# Altium project PCB_Project.PrjPcb (part 2 of 2)

## Sheet 12V_Buck_fans.SchDoc
size A; SheetNumber: 7; SheetTotal: 17
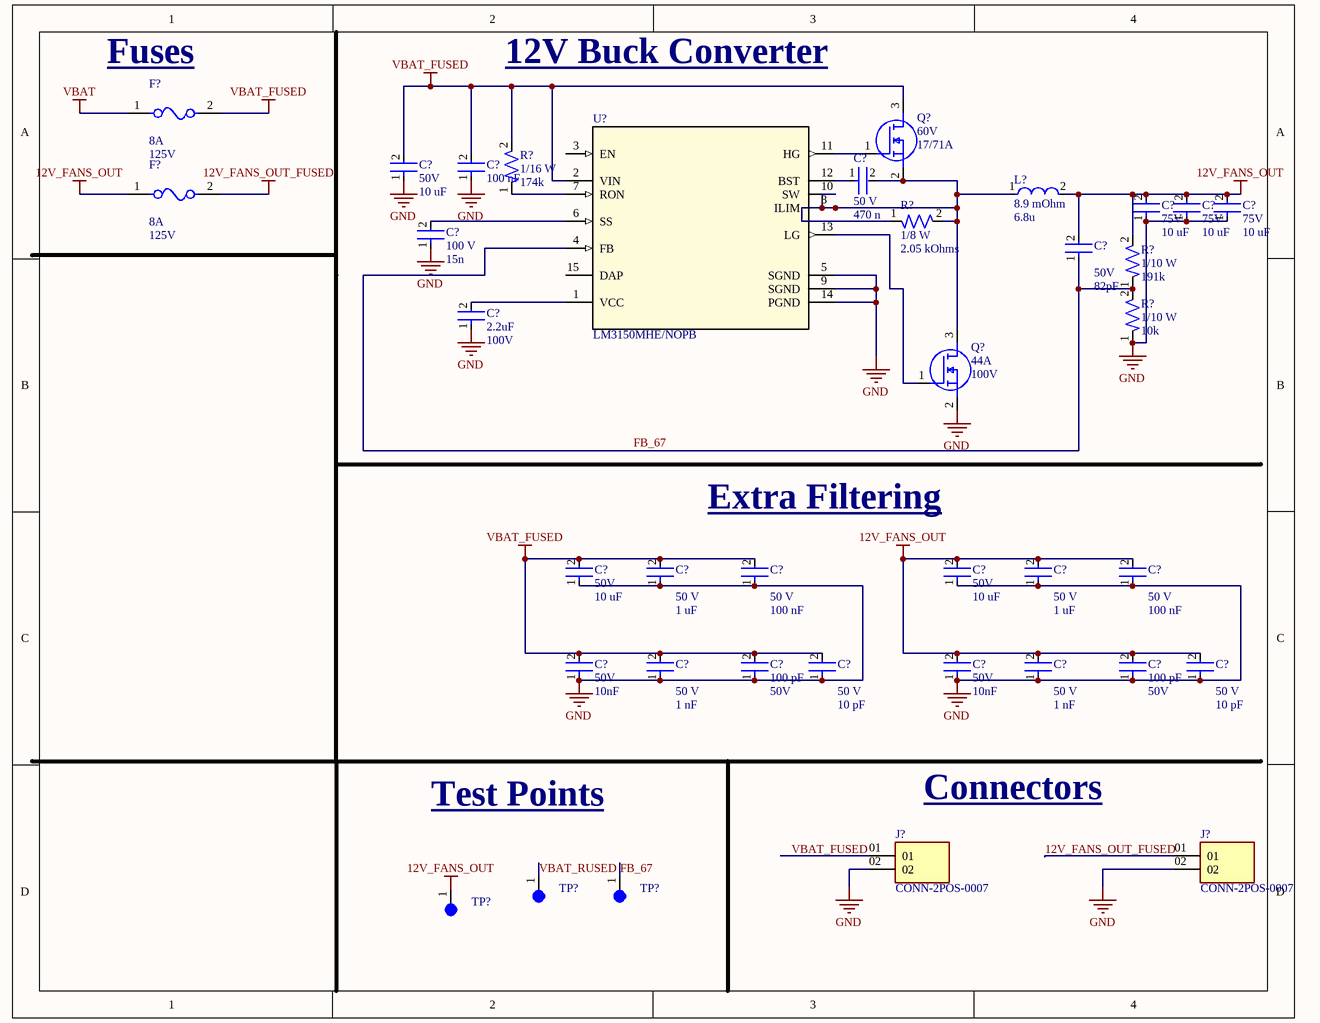
[diagram p6: 12V_Buck_fans.SchDoc]

### Parts
(Parts that share a designator on the sheet are numbered #1, #2 ... from top to bottom, then left to right.)
C?#113  Capacitance: 100 nF  [CAP-0603]  (hidden comment: GMC10X7S104K100NT)
C?#114  Voltage: 50V  Capacitance: 10 uF  [CAP-1210]  (hidden comment: CL32B106KBJNNNE)
C?#115  Voltage: 50 V  Capacitance: 470 n  [CAP-0805]  (hidden comment: CC0805ZRY5V9BB474)
C?#116  Voltage: 75V  Capacitance: 10 uF  [CAP-1210-0001]  (hidden comment: C3225X7R1N106K250AC)
C?#117  Voltage: 75V  Capacitance: 10 uF  [CAP-1210-0001]  (hidden comment: C3225X7R1N106K250AC)
C?#118  Voltage: 75V  Capacitance: 10 uF  [CAP-1210-0001]  (hidden comment: C3225X7R1N106K250AC)
C?#119  Voltage: 100 V  Capacitance: 15n  [CAP-0805]  (hidden comment: CC0805KRX7R0BB153)
C?#120  Voltage: 50V  Capacitance: 82pF  [CAP-0805]  (hidden comment: CC0805JRNPO9BN820)
C?#121  Capacitance: 2.2uF  Voltage: 100V  [CAP-1206]  (hidden comment: CC1206KKX7R0BB225)
C?#122  Voltage: 50 V  Capacitance: 1 uF  [CAP-0805]  (hidden comment: CC0805KKX7R9BB105)
C?#123  Voltage: 50 V  Capacitance: 100 nF  [CAP-0805]  (hidden comment: CC0805KRX7R9BB104)
C?#124  Voltage: 50 V  Capacitance: 1 uF  [CAP-0805]  (hidden comment: CC0805KKX7R9BB105)
C?#125  Voltage: 50 V  Capacitance: 100 nF  [CAP-0805]  (hidden comment: CC0805KRX7R9BB104)
C?#126  Voltage: 50V  Capacitance: 10 uF  [CAP-1210]  (hidden comment: CL32B106KBJNNNE)
C?#127  Voltage: 50V  Capacitance: 10 uF  [CAP-1210]  (hidden comment: CL32B106KBJNNNE)
C?#128  Voltage: 50 V  Capacitance: 1 nF  [CAP-0402]  (hidden comment: CC0402KRX7R9BB102)
C?#129  Voltage: 50 V  Capacitance: 10 pF  [CAP-0402]  (hidden comment: CC0402JRNPO9BN100)
C?#130  Voltage: 50 V  Capacitance: 1 nF  [CAP-0402]  (hidden comment: CC0402KRX7R9BB102)
C?#131  Voltage: 50 V  Capacitance: 10 pF  [CAP-0402]  (hidden comment: CC0402JRNPO9BN100)
C?#132  Voltage: 50V  Capacitance: 10nF  [CAP-0805]  (hidden comment: GRM2195C1H103JA01D)
C?#133  Capacitance: 100 pF  Voltage: 50V  [CAP-0402]  (hidden comment: CC0402JRNPO9BN101)
C?#134  Voltage: 50V  Capacitance: 10nF  [CAP-0805]  (hidden comment: GRM2195C1H103JA01D)
C?#135  Capacitance: 100 pF  Voltage: 50V  [CAP-0402]  (hidden comment: CC0402JRNPO9BN101)
F?#11  Fuse Current: 8A  Voltage Rating: 125V  [FUSE-0001]  (hidden comment: 01550900M)
F?#12  Fuse Current: 8A  Voltage Rating: 125V  [FUSE-0001]  (hidden comment: 01550900M)
J?#12  CONN-2POS-0007  [SAMTEC_HFWJ-02-02-T-S]
J?#13  CONN-2POS-0007  [SAMTEC_HFWJ-02-02-T-S]
L?#6  Resistance: 8.9 mOhm  Inductance: 6.8u  (hidden comment: XAL1010-682MED)
Q?#12  Vdss: 60V  Current: 17/71A  [NTMFS5C670NLT1G_ONS]  (hidden comment: NTMFS5C670NLT1G)
Q?#13  Current: 44A  Vdss: 100V  [TRANS_CSD19534Q5A]  (hidden comment: CSD19534Q5A)
R?#24  Power: 1/16 W  Resistance: 174k  [RES-0402]  (hidden comment: RC0402FR-07174KL)
R?#25  Power: 1/8 W  Resistance: 2.05 kOhms  [RES-0805]  (hidden comment: RC0805FR-072K05L)
R?#26  Power: 1/10 W  Resistance: 191k  [RES-0603]  (hidden comment: AC0603FR-07191KL)
R?#27  Power: 1/10 W  Resistance: 10k  [CAP-0603]  (hidden comment: RC0603FR-0710KL)
TP?#17  5003  [TEST-POINT-0001]  (value not drawn)
TP?#18  5003  [TEST-POINT-0001]  (value not drawn)
TP?#19  5003  [TEST-POINT-0001]  (value not drawn)
U?#6  LM3150MHE/NOPB  [MXA14A]

### Nets
12V_FANS_OUT: C?#116.2 C?#117.2 C?#118.2 C?#120.2 C?#124.2 C?#125.2 C?#127.2 C?#130.2 C?#131.2 C?#134.2 C?#135.2 F?#12.1 L?#6.2 R?#26.2 TP?#19.1
12V_FANS_OUT_FUSED: F?#12.2 J?#13.01
GND: C?#113.1 C?#114.1 C?#116.1 C?#117.1 C?#118.1 C?#119.1 C?#121.1 C?#122.1 C?#123.1 C?#124.1 C?#125.1 C?#126.1 C?#127.1 C?#128.1 C?#129.1 C?#130.1 C?#131.1 C?#132.1 C?#133.1 C?#134.1 C?#135.1 J?#12.02 J?#13.02 Q?#13.2(S) R?#27.1 U?#6.5(SGND) U?#6.9(SGND) U?#6.14(PGND)
VBAT: F?#11.1
VBAT_FUSED: C?#113.2 C?#114.2 C?#122.2 C?#123.2 C?#126.2 C?#128.2 C?#129.2 C?#132.2 C?#133.2 F?#11.2 Q?#12.3(D) R?#24.2 U?#6.2(VIN)
FB_67: C?#120.1 R?#26.1 R?#27.2 TP?#18.1 U?#6.4(FB)
VBAT_RUSED: TP?#17.1
NetC?#115_1: C?#115.1 U?#6.12(BST)
NetC?#115_2: C?#115.2 L?#6.1 Q?#12.2(S) Q?#13.3(D) R?#25.1 R?#25.2 U?#6.8(ILIM) U?#6.10(SW)
NetC?#119_2: C?#119.2 U?#6.6(SS)
NetC?#121_2: C?#121.2 U?#6.1(VCC)
NetQ?#12_1: Q?#12.1(G) U?#6.11(HG)
NetQ?#13_1: Q?#13.1(G) U?#6.13(LG)
NetR?#24_1: R?#24.1 U?#6.7(RON)

Not connected (* = marked no-connect by the designer): J?#12 01; U?#6 3(EN) 15(DAP)

### Notes on the sheet
- (near F?#11) Fuses
- 12V Buck Converter
- (near C?#123) Extra Filtering
- Test Points
- Connectors
- Labels drawn without touching a wire or pin: VBAT_FUSED

### Library data of the parts
C?#113 = CAP-100N-0001: 0.1 µF ±10% 100V Ceramic Capacitor X7S 0603 (1608 Metric)
C?#114 C?#126 C?#127 = CAP-10U-0002: CAP CER 10UF 50V X7R 1210; Device Class: Ceramic; Size: 1210; ComponentLink1Description: Datasheet; ComponentLink1URL: https://mm.digikey.com/Volume0/opasdata/d220001/medias/docus/41/CL32B106KBJNNNE_Spec.pdf
C?#115 = CAP-470N-0002: 0.47 µF -20%, +80% 50V Ceramic Capacitor Y5V (F) 0805 (2012 Metric)
C?#116-C?#118 = CAP-10U-0003: CAP CER 10UF 75V X7R 1210; Device Class: Ceramic; Size: 1210; ComponentLink1Description: Datasheet; ComponentLink1URL: https://mm.digikey.com/Volume0/opasdata/d220001/medias/docus/41/CL32B106KBJNNNE_Spec.pdf
C?#119 = CAP-15N-0001: 0.015 µF ±10% 100V Ceramic Capacitor X7R 0805 (2012 Metric)
C?#120 = CAP-82P-0001: 82 pF ±5% 50V Ceramic Capacitor C0G, NP0 0805 (2012 Metric)
C?#121 = CAP-2.2U-0001: CAP CER 2.2UF 100V X7R 1206; Device Class: Ceramic; Size: 1206; ComponentLink1Description: Datasheet; ComponentLink1URL: https://www.yageo.com/upload/media/product/productsearch/datasheet/mlcc/UPY-GPHC_X7R_6.3V-to-250V_24.pdf
C?#122 C?#124 = CAP-1U-0001: 1 µF ±10% 50V Ceramic Capacitor X7R 0805 (2012 Metric)
C?#123 C?#125 = CAP-100N-0002: 0.1 µF ±10% 50V Ceramic Capacitor X7R 0805 (2012 Metric)
C?#128 C?#130 = CAP-1N-0001: 1000 pF ±10% 50V Ceramic Capacitor X7R 0402 (1005 Metric)
C?#129 C?#131 = CAP-10P-0001: 10 pF ±5% 50V Ceramic Capacitor C0G, NP0 0402 (1005 Metric)
C?#132 C?#134 = CAP-10N-0001: CAP CER 10000PF 50V C0G/NP0 0805; Device Class: Ceramic; Size: 0805; ComponentLink1Description: Datasheet; ComponentLink1URL: https://search.murata.co.jp/Ceramy/image/img/A01X/G101/ENG/GRM2195C1H103JA01-01.pdf
C?#133 C?#135 = CAP-100P-0001: CAP CER 100PF 50V C0G/NPO 0402; Device Class: Ceramic; Size: 0402; ComponentLink1Description: Datasheet; ComponentLink1URL: https://www.yageo.com/upload/media/product/productsearch/datasheet/mlcc/UPY-GP_NP0_16V-to-50V_18.pdf
F?#11 F?#12 = FUSE-0001: FUSE BLOK CARTRIDGE 125V 10A SMD; ComponentLink2Description: Datasheet; ComponentLink2URL: https://www.littelfuse.com/~/media/electronics/datasheets/fuses/littelfuse_fuse_154_154t_154l_154tl_datasheet.pdf.pdf
J?#12 J?#13 = CONN-2POS-0007: Conn Unshrouded Header HDR 2 POS 3.96mm Solder ST Thru-Hole Bulk; MF: Samtec; MP: HFWJ-02-02-T-S; SnapEDA_Link: https://www.snapeda.com/parts/HFWJ-02-02-T-S/Samtec/view-part/?ref=snap; Package: None; Value: *; Check_prices: https://www.snapeda.com/parts/HFWJ-02-02-T-S/Samtec/view-part/?ref=eda
L?#6 = IND-6.8u-0001: 6.8 µH Shielded Molded Inductor 14 A 8.9mOhm Max Nonstandard
Q?#12 = MOS-17/71A-0001: MOSFET N-CH 60V 17A/71A 5DFN; Manufacturer_Name: onsemi; Vth: 2V; Copyright: Copyright (C) 2025 Ultra Librarian. All rights reserved.; Manufacturer_Part_Number: NTMFS5C670NLT1G; RefDes: RefDes; Type: Type
Q?#13 = MOS-44A-0001: 100V, N ch NexFET MOSFET, single SON5x6, 15.1mOhm 8-VSONP -55 to 150; MF: Texas Instruments; Vth: 3.4V; Mouser-Purchase-URL: https://snapeda.com/shop?store=Mouser&id=485742; Package: VSONP-8 Texas Instruments; Texas_Instruments-Purchase-URL: https://snapeda.com/shop?store=Texas+Instruments&id=485742; Value: *; Price: None; DigiKey-Purchase-URL: https://snapeda.com/shop?store=DigiKey&id=485742; MP: CSD19534Q5A; SnapEDA_Link: https://www.snapeda.com/parts/CSD19534Q5A/Texas%20Instruments/view-part/485742/?ref=snap; Availability: Good
R?#24 = RES-174K-0001: RES 174K OHM 1% 1/16W 0402
R?#25 = RES-2.05k-0001: 2.05 kOhms ±1% 0.125W, 1/8W Chip Resistor 0805 (2012 Metric) Moisture Resistant Thick Film
R?#26 = RES-191K-001: 191 kOhms ±1% 0.1W, 1/10W Chip Resistor 0603 (1608 Metric) Automotive AEC-Q200, Moisture Resistant Thick Film
R?#27 = RES-10k-0002: 10 kOhms ±1% 0.1W, 1/10W Chip Resistor 0603 (1608 Metric) Moisture Resistant Thick Film
TP?#17-TP?#19 = TEST-POINT-0001: Oranange PC Test Point, Miniature Phoisphor Bronze Silver Plating Through Hole Mounting Type
U?#6 = IC-BUCK_0011: 6V to 42V Synchronous Step-Down Controller with Adjustable Output Voltage 14-HTSSOP -40 to 125; Manufacturer_Name: Texas Instruments; Copyright: Copyright (C) 2025 Ultra Librarian. All rights reserved.; Manufacturer_Part_Number: LM3150MHE/NOPB; Datasheet: https://www.ti.com/lit/gpn/lm3150; RefDes: RefDes; Type: Type

## Sheet 7V_Buck.SchDoc
size A; SheetNumber: 5; SheetTotal: 16
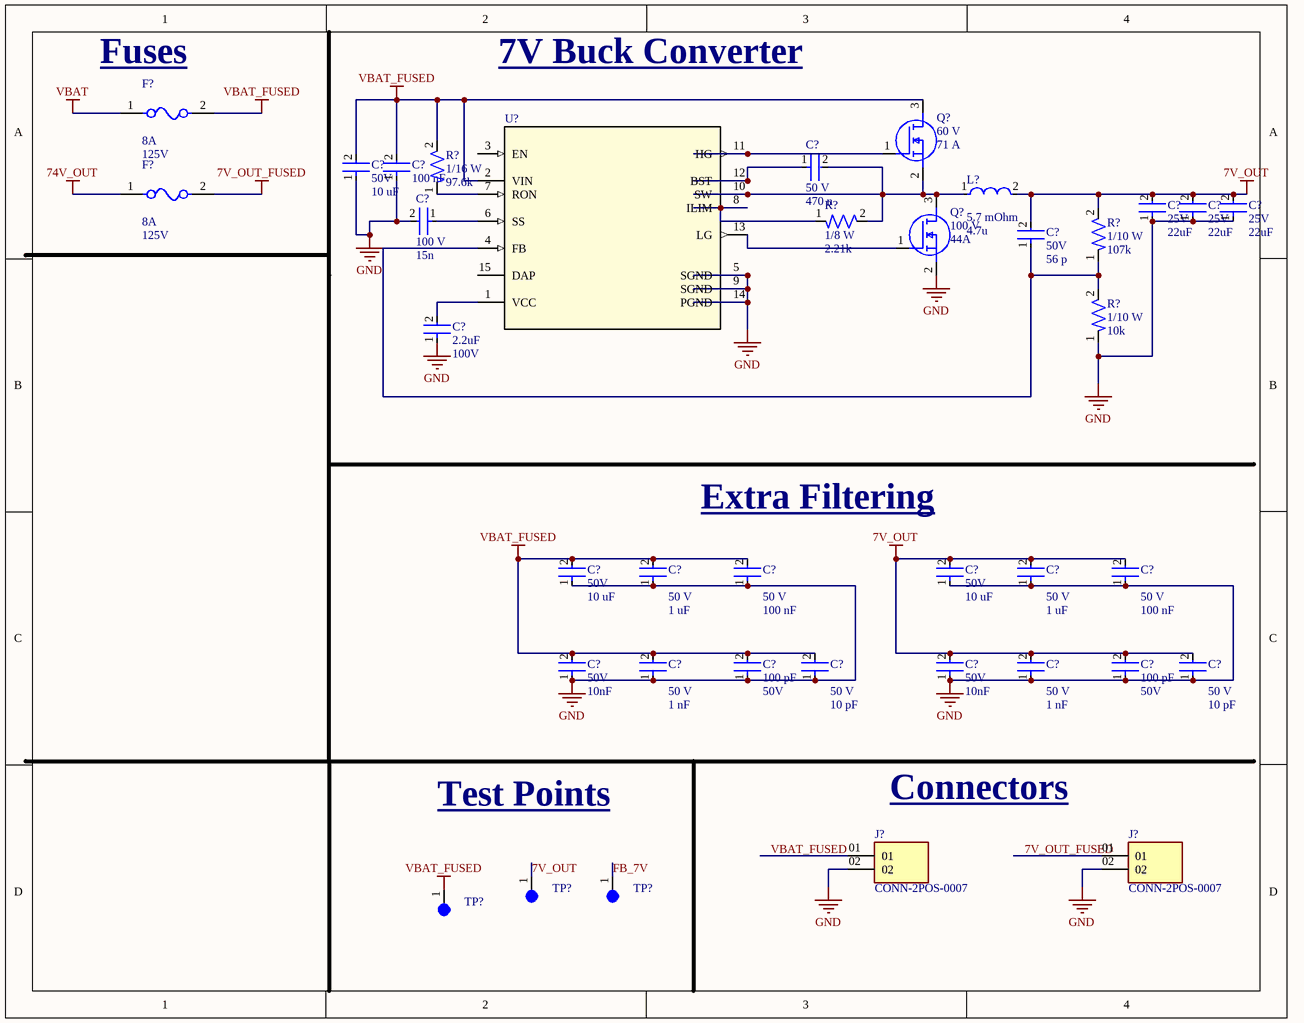
[diagram p7: 7V_Buck.SchDoc]

### Parts
(Parts that share a designator on the sheet are numbered #1, #2 ... from top to bottom, then left to right.)
C?#136  Capacitance: 100 nF  [CAP-0603]  (hidden comment: GMC10X7S104K100NT)
C?#137  Voltage: 50 V  Capacitance: 470 n  [CAP-0805]  (hidden comment: CC0805ZRY5V9BB474)
C?#138  Voltage: 50V  Capacitance: 10 uF  [CAP-1210]  (hidden comment: CL32B106KBJNNNE)
C?#139  Voltage: 100 V  Capacitance: 15n  [CAP-0805]  (hidden comment: CC0805KRX7R0BB153)
C?#140  Voltage: 25V  Capacitance: 22uF  [CAP-1210]  (hidden comment: GRM32ER61E226KE15L)
C?#141  Voltage: 25V  Capacitance: 22uF  [CAP-1210]  (hidden comment: GRM32ER61E226KE15L)
C?#142  Voltage: 25V  Capacitance: 22uF  [CAP-1210]  (hidden comment: GRM32ER61E226KE15L)
C?#143  Voltage: 50V  Capacitance: 56 p  [CAP-0402]  (hidden comment: CC0402JRNPO9BN560)
C?#144  Capacitance: 2.2uF  Voltage: 100V  [CAP-1206]  (hidden comment: CC1206KKX7R0BB225)
C?#145  Voltage: 50 V  Capacitance: 1 uF  [CAP-0805]  (hidden comment: CC0805KKX7R9BB105)
C?#146  Voltage: 50 V  Capacitance: 100 nF  [CAP-0805]  (hidden comment: CC0805KRX7R9BB104)
C?#147  Voltage: 50 V  Capacitance: 1 uF  [CAP-0805]  (hidden comment: CC0805KKX7R9BB105)
C?#148  Voltage: 50 V  Capacitance: 100 nF  [CAP-0805]  (hidden comment: CC0805KRX7R9BB104)
C?#149  Voltage: 50V  Capacitance: 10 uF  [CAP-1210]  (hidden comment: CL32B106KBJNNNE)
C?#150  Voltage: 50V  Capacitance: 10 uF  [CAP-1210]  (hidden comment: CL32B106KBJNNNE)
C?#151  Voltage: 50 V  Capacitance: 1 nF  [CAP-0402]  (hidden comment: CC0402KRX7R9BB102)
C?#152  Voltage: 50 V  Capacitance: 10 pF  [CAP-0402]  (hidden comment: CC0402JRNPO9BN100)
C?#153  Voltage: 50 V  Capacitance: 1 nF  [CAP-0402]  (hidden comment: CC0402KRX7R9BB102)
C?#154  Voltage: 50 V  Capacitance: 10 pF  [CAP-0402]  (hidden comment: CC0402JRNPO9BN100)
C?#155  Voltage: 50V  Capacitance: 10nF  [CAP-0805]  (hidden comment: GRM2195C1H103JA01D)
C?#156  Capacitance: 100 pF  Voltage: 50V  [CAP-0402]  (hidden comment: CC0402JRNPO9BN101)
C?#157  Voltage: 50V  Capacitance: 10nF  [CAP-0805]  (hidden comment: GRM2195C1H103JA01D)
C?#158  Capacitance: 100 pF  Voltage: 50V  [CAP-0402]  (hidden comment: CC0402JRNPO9BN101)
F?#13  Fuse Current: 8A  Voltage Rating: 125V  [FUSE-0001]  (hidden comment: 01550900M)
F?#14  Fuse Current: 8A  Voltage Rating: 125V  [FUSE-0001]  (hidden comment: 01550900M)
J?#14  CONN-2POS-0007  [SAMTEC_HFWJ-02-02-T-S]
J?#15  CONN-2POS-0007  [SAMTEC_HFWJ-02-02-T-S]
L?#7  Resistance: 5.7 mOhm  Inductance: 4.7u  [IND_XAL1010_COC]  (hidden comment: XAL1010-472MED)
Q?#14  Voltage Max: 100 V  Current Max: 44A  [TRANS_CSD19534Q5A]  (hidden comment: CSD19534Q5A)
Q?#15  Max Voltage: 60 V  Max Current: 71 A  [NTMFS5C670NLT1G_ONS]  (hidden comment: NTMFS5C670NLT1G)
R?#28  Power: 1/16 W  Resistance: 97.6k  [RES-0402]  (hidden comment: RC0402FR-0797K6L)
R?#29  Power: 1/8 W  Resistance: 2.21k  [RES-0805]  (hidden comment: RT0805BRD072K21L)
R?#30  Power: 1/10 W  Resistance: 107k  [RES-0603]  (hidden comment: RC0603FR-07107KL)
R?#31  Power: 1/10 W  Resistance: 10k  [CAP-0603]  (hidden comment: RC0603FR-0710KL)
TP?#20  5003  [TEST-POINT-0001]  (value not drawn)
TP?#21  5003  [TEST-POINT-0001]  (value not drawn)
TP?#22  5003  [TEST-POINT-0001]  (value not drawn)
U?#7  LM3150MHE/NOPB  [MXA14A]  (value not drawn)

### Nets
7V_OUT: C?#140.2 C?#141.2 C?#142.2 C?#143.2 C?#147.2 C?#148.2 C?#150.2 C?#153.2 C?#154.2 C?#157.2 C?#158.2 L?#7.2 R?#30.2 TP?#20.1
7V_OUT_FUSED: F?#14.2
74V_OUT: F?#14.1
GND: C?#136.1 C?#138.1 C?#139.2 C?#140.1 C?#141.1 C?#142.1 C?#144.1 C?#145.1 C?#146.1 C?#147.1 C?#148.1 C?#149.1 C?#150.1 C?#151.1 C?#152.1 C?#153.1 C?#154.1 C?#155.1 C?#156.1 C?#157.1 C?#158.1 J?#14.02 J?#15.02 Q?#14.2(S) R?#31.1 U?#7.5(SGND) U?#7.9(SGND) U?#7.14(PGND)
VBAT: F?#13.1
VBAT_FUSED: C?#136.2 C?#138.2 C?#145.2 C?#146.2 C?#149.2 C?#151.2 C?#152.2 C?#155.2 C?#156.2 F?#13.2 Q?#15.3(D) R?#28.2 TP?#22.1 U?#7.2(VIN)
FB_7V: TP?#21.1
NetC?#137_1: C?#137.1 U?#7.12(BST)
NetC?#137_2: C?#137.2 L?#7.1 Q?#14.3(D) Q?#15.2(S) R?#29.2 U?#7.10(SW)
NetC?#139_1: C?#139.1 U?#7.6(SS)
NetC?#143_1: C?#143.1 R?#30.1 R?#31.2 U?#7.4(FB)
NetC?#144_2: C?#144.2 U?#7.1(VCC)
NetQ?#14_1: Q?#14.1(G) U?#7.13(LG)
NetQ?#15_1: Q?#15.1(G) U?#7.11(HG)
NetR?#28_1: R?#28.1 U?#7.7(RON)
NetR?#29_1: R?#29.1 U?#7.8(ILIM)

Not connected (* = marked no-connect by the designer): J?#14 01; J?#15 01; U?#7 3(EN) 15(DAP)

### Notes on the sheet
- (near F?#13) Fuses
- 7V Buck Converter
- (near C?#146) Extra Filtering
- Test Points
- (near J?#14) Connectors
- Labels drawn without touching a wire or pin: 7V_OUT_FUSED, VBAT_FUSED

### Library data of the parts
C?#136 = CAP-100N-0001: as C?#113 on sheet 12V_Buck_fans
C?#137 = CAP-470N-0002: as C?#115 on sheet 12V_Buck_fans
C?#138 C?#149 C?#150 = CAP-10U-0002: CAP CER 10UF 50V X7R 1210; Device Class: Ceramic; Size: 1210; ComponentLink1Description: Datasheet; ComponentLink1URL: https://mm.digikey.com/Volume0/opasdata/d220001/medias/docus/41/CL32B106KBJNNNE_Spec.pdf
C?#139 = CAP-15N-0001: as C?#119 on sheet 12V_Buck_fans
C?#140-C?#142 = CAP-22U-0001: CAP CER 22UF 25V X5R 1210; ComponentLink2Description: Datasheet; ComponentLink2URL: https://search.murata.co.jp/Ceramy/image/img/A01X/G101/ENG/GRM32ER61E226KE15-01A.pdf; Device Class: Ceramic; Size: 1210
C?#143 = CAP-56p-0001: 56 pF ±5% 50V Ceramic Capacitor C0G, NP0 0402 (1005 Metric)
C?#144 = CAP-2.2U-0001: CAP CER 2.2UF 100V X7R 1206; Device Class: Ceramic; Size: 1206; ComponentLink1Description: Datasheet; ComponentLink1URL: https://www.yageo.com/upload/media/product/productsearch/datasheet/mlcc/UPY-GPHC_X7R_6.3V-to-250V_24.pdf
C?#145 C?#147 = CAP-1U-0001: as C?#122 on sheet 12V_Buck_fans
C?#146 C?#148 = CAP-100N-0002: as C?#123 on sheet 12V_Buck_fans
C?#151 C?#153 = CAP-1N-0001: as C?#128 on sheet 12V_Buck_fans
C?#152 C?#154 = CAP-10P-0001: as C?#129 on sheet 12V_Buck_fans
C?#155 C?#157 = CAP-10N-0001: CAP CER 10000PF 50V C0G/NP0 0805; Device Class: Ceramic; Size: 0805; ComponentLink1Description: Datasheet; ComponentLink1URL: https://search.murata.co.jp/Ceramy/image/img/A01X/G101/ENG/GRM2195C1H103JA01-01.pdf
C?#156 C?#158 = CAP-100P-0001: CAP CER 100PF 50V C0G/NPO 0402; Device Class: Ceramic; Size: 0402; ComponentLink1Description: Datasheet; ComponentLink1URL: https://www.yageo.com/upload/media/product/productsearch/datasheet/mlcc/UPY-GP_NP0_16V-to-50V_18.pdf
F?#13 F?#14 = FUSE-0001: FUSE BLOK CARTRIDGE 125V 10A SMD; ComponentLink2Description: Datasheet; ComponentLink2URL: https://www.littelfuse.com/~/media/electronics/datasheets/fuses/littelfuse_fuse_154_154t_154l_154tl_datasheet.pdf.pdf
J?#14 J?#15 = CONN-2POS-0007: as J?#12 on sheet 12V_Buck_fans; SnapEDA_Link: https://www.snapeda.com/parts/HFWJ-02-02-T-S/Samtec/view-part/?ref=snap; Package: None; Value: *; Check_prices: https://www.snapeda.com/parts/HFWJ-02-02-T-S/Samtec/view-part/?ref=eda
L?#7 = IND-4.7u-0001: 4.7 ÂµH Shielded Molded Inductor 17.5 A 5.7mOhm Max Nonstandard
Q?#14 = NMOS-44A-0001: N-Channel 100 V 44A (Tc) 3.2W (Ta), 63W (Tc) Surface Mount 8-VSONP (5x6); MF: Texas Instruments; Mouser-Purchase-URL: https://snapeda.com/shop?store=Mouser&id=485742; Package: VSONP-8 Texas Instruments; Texas_Instruments-Purchase-URL: https://snapeda.com/shop?store=Texas+Instruments&id=485742; Value: *; Price: None; DigiKey-Purchase-URL: https://snapeda.com/shop?store=DigiKey&id=485742; MP: CSD19534Q5A; SnapEDA_Link: https://www.snapeda.com/parts/CSD19534Q5A/Texas%20Instruments/view-part/485742/?ref=snap; Availability: Good
Q?#15 = NMOS-71A-0001: N-Channel 60 V 17A (Ta), 71A (Tc) 3.6W (Ta), 61W (Tc) Surface Mount 5-DFN (5x6) (8-SOFL); Manufacturer_Name: onsemi; Copyright: Copyright (C) 2025 Ultra Librarian. All rights reserved.; Manufacturer_Part_Number: NTMFS5C670NLT1G; RefDes: RefDes; Type: Type
R?#28 = RES-97.6k-0001: 97.6 kOhms ±1% 0.063W, 1/16W Chip Resistor 0402 (1005 Metric) Moisture Resistant Thick Film
R?#29 = RES-2.21K-0001: 2.21 kOhms ±0.1% 0.125W, 1/8W Chip Resistor 0805 (2012 Metric) Thin Film
R?#30 = RES-107k-0001: 107 kOhms ±1% 0.1W, 1/10W Chip Resistor 0603 (1608 Metric) Moisture Resistant Thick Film
R?#31 = RES-10k-0002: as R?#27 on sheet 12V_Buck_fans
TP?#20-TP?#22 = TEST-POINT-0001: as TP?#17 on sheet 12V_Buck_fans
U?#7 = IC-BUCK_0011: as U?#6 on sheet 12V_Buck_fans; Copyright: Copyright (C) 2025 Ultra Librarian. All rights reserved.; Manufacturer_Part_Number: LM3150MHE/NOPB; Datasheet: https://www.ti.com/lit/gpn/lm3150; RefDes: RefDes; Type: Type

## Sheet MCU.SchDoc
size 381 x 241 mm; SheetNumber: 5; SheetTotal: 8
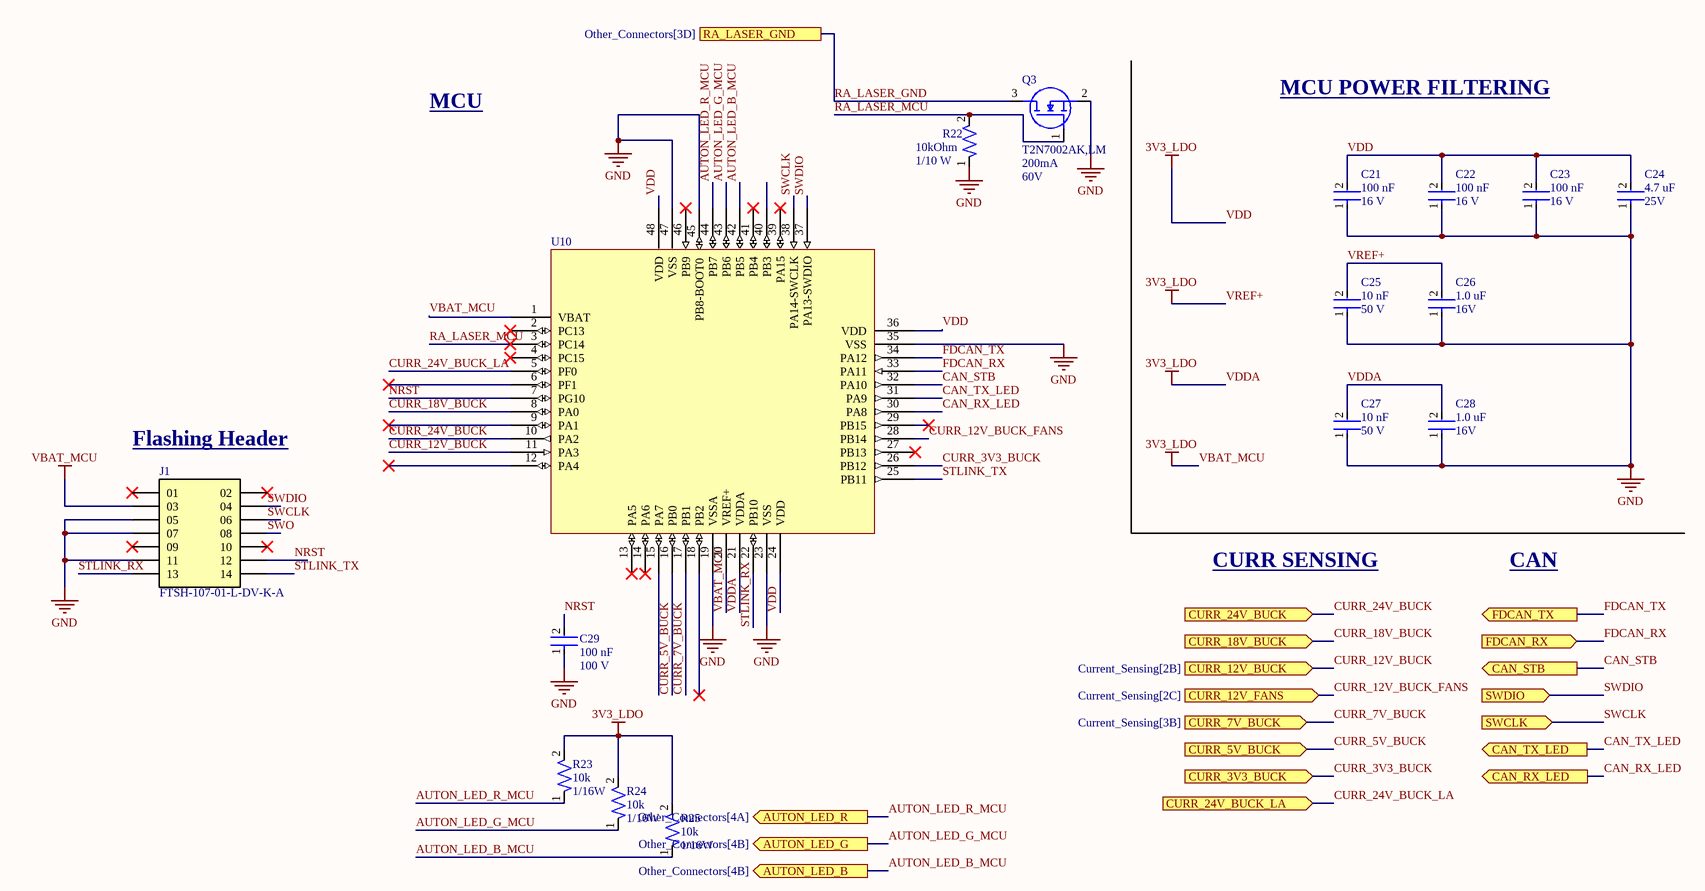
[diagram p8: MCU.SchDoc]

### Parts
C21  Voltage Rating: 16 V  Capacitance: 100 nF  [CAP-0402]  (hidden comment: CC0402KRX7R7BB104)
C22  Voltage Rating: 16 V  Capacitance: 100 nF  [CAP-0402]  (hidden comment: CC0402KRX7R7BB104)
C23  Voltage Rating: 16 V  Capacitance: 100 nF  [CAP-0402]  (hidden comment: CC0402KRX7R7BB104)
C24  Capacitance: 4.7 uF  Voltage: 25V  [CAP-0603]  (hidden comment: CC0603KRX5R8BB475)
C25  Voltage: 50 V  Capacitance: 10 nF  [CAP-0603]  (hidden comment: CC0603KPX7R9BB103)
C26  Capacitance: 1.0 uF  Voltage: 16V  [CAP-0603]  (hidden comment: CC0603KRX7R7BB105)
C27  Voltage: 50 V  Capacitance: 10 nF  [CAP-0603]  (hidden comment: CC0603KPX7R9BB103)
C28  Capacitance: 1.0 uF  Voltage: 16V  [CAP-0603]  (hidden comment: CC0603KRX7R7BB105)
C29  Capacitance: 100 nF  Voltage: 100 V  [CAP-0603]  (hidden comment: CC0603KRX7R0BB104)
J1  FTSH-107-01-L-DV-K-A  [SAMTEC_FTSH-107-01-L-DV-K]
Q3  T2N7002AK,LM  Id-Continuous: 200mA  VDS-Max: 60V  [NMOS-SOT23-3]
R22  Resistance: 10kOhm  Power: 1/10 W  [RES-0603]  (hidden comment: RMCF0603ZT0R00)
R23  Resistance: 10k  Power: 1/16W  [RES-0402]  (hidden comment: RC0402FR-0710KL)
R24  Resistance: 10k  Power: 1/16W  [RES-0402]  (hidden comment: RC0402FR-0710KL)
R25  Resistance: 10k  Power: 1/16W  [RES-0402]  (hidden comment: RC0402FR-0710KL)
U10  STM32G431CBT6  [IC-LQFP48]  (value not drawn)

### Ports
AUTON_LED_B (out, see Other_Connectors[4B]), AUTON_LED_G (out, see Other_Connectors[4B]), AUTON_LED_R (out, see Other_Connectors[4A]), CAN_RX_LED (out, see CAN_Transciever[1C]), CAN_STB (out, see CAN_Transciever[1C]), CAN_TX_LED (out, see CAN_Transciever[1C]), CURR_3V3_BUCK (in, see Current_Sensing[5B]), CURR_5V_BUCK (in, see Current_Sensing[5B]), CURR_7V_BUCK (in, see Current_Sensing[3B]), CURR_12V_BUCK (in, see Current_Sensing[2B]), CURR_12V_FANS (in, see Current_Sensing[2C]), CURR_18V_BUCK (in, see Current_Sensing[3B]), CURR_24V_BUCK (in, see Current_Sensing[2B]), CURR_24V_BUCK_LA (in, see Current_Sensing[4C]), FDCAN_RX (in, see CAN_Transciever[1C]), FDCAN_TX (out, see CAN_Transciever[1C]), RA_LASER_GND (see Other_Connectors[3D]), SWCLK (in), SWDIO (in)

### Nets
GND: C21.1 C22.1 C23.1 C24.1 C25.1 C26.1 C27.1 C28.1 C29.1 J1.05 J1.07 J1.11 Q3.2(S) R22.1 U10.19(VSSA) U10.23(VSS) U10.35(VSS) U10.45(PB8-BOOT0) U10.47(VSS)
VBAT_MCU: C21.2 C22.2 C23.2 C24.2 C25.2 C26.2 C27.2 C28.2 J1.03 R23.2 R24.2 R25.2 U10.1(VBAT) U10.20(VREF+) U10.21(VDDA) U10.24(VDD) U10.36(VDD) U10.48(VDD)  [also labelled 3V3_LDO, VDD, VDDA, VREF+]
AUTON_LED_B_MCU: R25.1 U10.42(PB5) ; port AUTON_LED_B
AUTON_LED_G_MCU: R24.1 U10.43(PB6) ; port AUTON_LED_G
AUTON_LED_R_MCU: R23.1 U10.44(PB7) ; port AUTON_LED_R
CAN_RX_LED: U10.30(PA8) ; port CAN_RX_LED
CAN_STB: U10.32(PA10) ; port CAN_STB
CAN_TX_LED: U10.31(PA9) ; port CAN_TX_LED
CURR_3V3_BUCK: U10.26(PB12) ; port CURR_3V3_BUCK
CURR_5V_BUCK: U10.16(PB0) ; port CURR_5V_BUCK
CURR_7V_BUCK: U10.17(PB1) ; port CURR_7V_BUCK
CURR_12V_BUCK: U10.11(PA3) ; port CURR_12V_BUCK
CURR_12V_BUCK_FANS: U10.28(PB14) ; port CURR_12V_FANS
CURR_18V_BUCK: U10.8(PA0) ; port CURR_18V_BUCK
CURR_24V_BUCK: U10.10(PA2) ; port CURR_24V_BUCK
CURR_24V_BUCK_LA: U10.5(PF0) ; port CURR_24V_BUCK_LA
FDCAN_RX: U10.33(PA11) ; port FDCAN_RX
FDCAN_TX: U10.34(PA12) ; port FDCAN_TX
NRST: C29.2 J1.12 U10.7(PG10)
RA_LASER_GND: Q3.3(D) ; port RA_LASER_GND
RA_LASER_MCU: Q3.1(G) R22.2 U10.3(PC14)
STLINK_RX: J1.13 U10.22(PB10)
STLINK_TX: J1.14 U10.25(PB11)
SWCLK: J1.06 U10.38(PA14-SWCLK) ; port SWCLK
SWDIO: J1.04 U10.37(PA13-SWDIO) ; port SWDIO
SWO: J1.08

Not connected (* = marked no-connect by the designer): J1 01* 02* 09* 10*; U10 2(PC13)* 4(PC15)* 6(PF1)* 9(PA1)* 12(PA4)* 13(PA5)* 14(PA6)* 15(PA7) 18(PB2)* 27(PB13)* 29(PB15)* 39(PA15)* 40(PB3) 41(PB4)* 46(PB9)*

### Notes on the sheet
- MCU
- MCU POWER FILTERING
- (near J1) Flashing Header
- CURR SENSING
- CAN

### Library data of the parts
C21-C23 = CAP-0.1U-0001: CAP CER 0.1UF 16V X7R 0402; ComponentLink2Description: Datasheet; ComponentLink2URL: https://www.yageo.com/upload/media/product/productsearch/datasheet/mlcc/UPY-GPHC_X7R_6.3V-to-250V_24.pdf; Device Class: Ceramic; Size: 0402
C24 = CAP-4.7U-0001: CAP CER 4.7UF 25V X5R 0603; Device Class: Ceramic; Size: 0603
C25 C27 = CAP-10N-0002: CAP CER 10000PF 50V X7R 0603; ComponentLink2Description: Datasheet; ComponentLink2URL: http://www.yageo.com/documents/recent/UPY-GPHC_X7R_6.3V-to-50V_18.pdf; Device Class: Ceramic; Size: 0603
C26 C28 = CAP-1U-0002: CAP CER 1UF 16V X7R 0603; Device Class: Ceramic; Size: 0603
C29 = CAP-100N-0001: CAP CER 0.1UF 100V X7R 0603; Device Class: Ceramic; Size: 0603; ComponentLink1Description: Datasheet; ComponentLink1URL: https://www.yageo.com/upload/media/product/app/datasheet/mlcc/upy-np0x7r_mv_100-to-630v.pdf
J1 = CONN-Flashing: Connector Header Surface Mount 14 position 0.050 (1.27mm); MF: Samtec Inc.; SnapEDA_Link: https://www.snapeda.com/parts/FTSH-107-01-L-DV-K-A/Samtec+Inc./view-part/?ref=snap; Package: None; Value: *; MP: FTSH-107-01-L-DV-K-A; Check_prices: https://www.snapeda.com/parts/FTSH-107-01-L-DV-K-A/Samtec+Inc./view-part/?ref=eda; ComponentLink1Description: Datasheet; ComponentLink1URL: https://mm.digikey.com/Volume0/opasdata/d220001/medias/docus/6209/ftsh-1xx-xx-xxx-dv-xxx-xxx-x-xx-mkt.pdf?_gl=1*1c8qhrp*_up*MQ..*_gs*MQ..&gclid=Cj0KCQjwndHEBhDVARIsAGh0g3BhbAROHH0tQxim6dYiCi7CVIKM-WvKYR8T8zWoEwepZ3CPXWTcBI4aAtXsEALw_wcB&gclsrc=aw.ds&gbraid=0AAAAADrbLlju0DZp9CUD_BKsHNp-CszV5
Q3 = NMOS-200MA-0001: MOSFET N-CH 60V 200MA SOT23; Manufacturer: Toshiba; FET type: N-Channel; Rds On-Max: 3.9Ohm; Vgs-Max: 20V; Assembled?: no; Manufacturer Part Number: T2N7002AK,LM; Package: SOT-23-3
R22 = RES-0-0001: 0 Ohms Jumper 0.1W, 1/10W Chip Resistor 0603 (1608 Metric) Automotive AEC-Q200 Thick Film; Package Size: 0603
R23-R25 = RES-10k-0001: RES 10K OHM 1% 1/16W 0402; Tolerance: 1%; Size: 0402; ComponentLink1Description: Datasheet; ComponentLink1URL: https://www.yageo.com/upload/media/product/products/datasheet/rchip/PYu-RC_Group_51_RoHS_L_12.pdf
U10 = IC-STM32G431CBT6: IC MCU 32BIT 128KB FLASH 48LQFP; Package: 48LQFP; ComponentLink1Description: Datasheet; ComponentLink1URL: https://www.st.com/resource/en/datasheet/stm32g431cb.pdf

## Nets that join several sheets
12V_AUTON_IN: 5V_Buck (8 pins), 3V3_Buck (9 pins)
12V_FANS_OUT: 12V_Auton (7 pins), 12V_Buck_fans (15 pins)
GND: pdb26 (J?#1.2), 24V_Buck_LA (27 pins), 18V_Jetson (28 pins), 5V_Buck (28 pins), 3V3_Buck (28 pins), 12V_Auton (28 pins), 12V_Buck_fans (28 pins), 7V_Buck (28 pins), MCU (19 pins)
VBAT: 24V_Buck_LA (F?#1.1), 18V_Jetson (F?#3.1), 12V_Auton (F?#9.1), 12V_Buck_fans (F?#11.1), 7V_Buck (F?#13.1)
VBAT_FUSED: 24V_Buck_LA (14 pins), 18V_Jetson (14 pins), 12V_Auton (14 pins), 12V_Buck_fans (13 pins), 7V_Buck (14 pins)